# Altium schematic sheet InputOutput.SchDoc
size A4
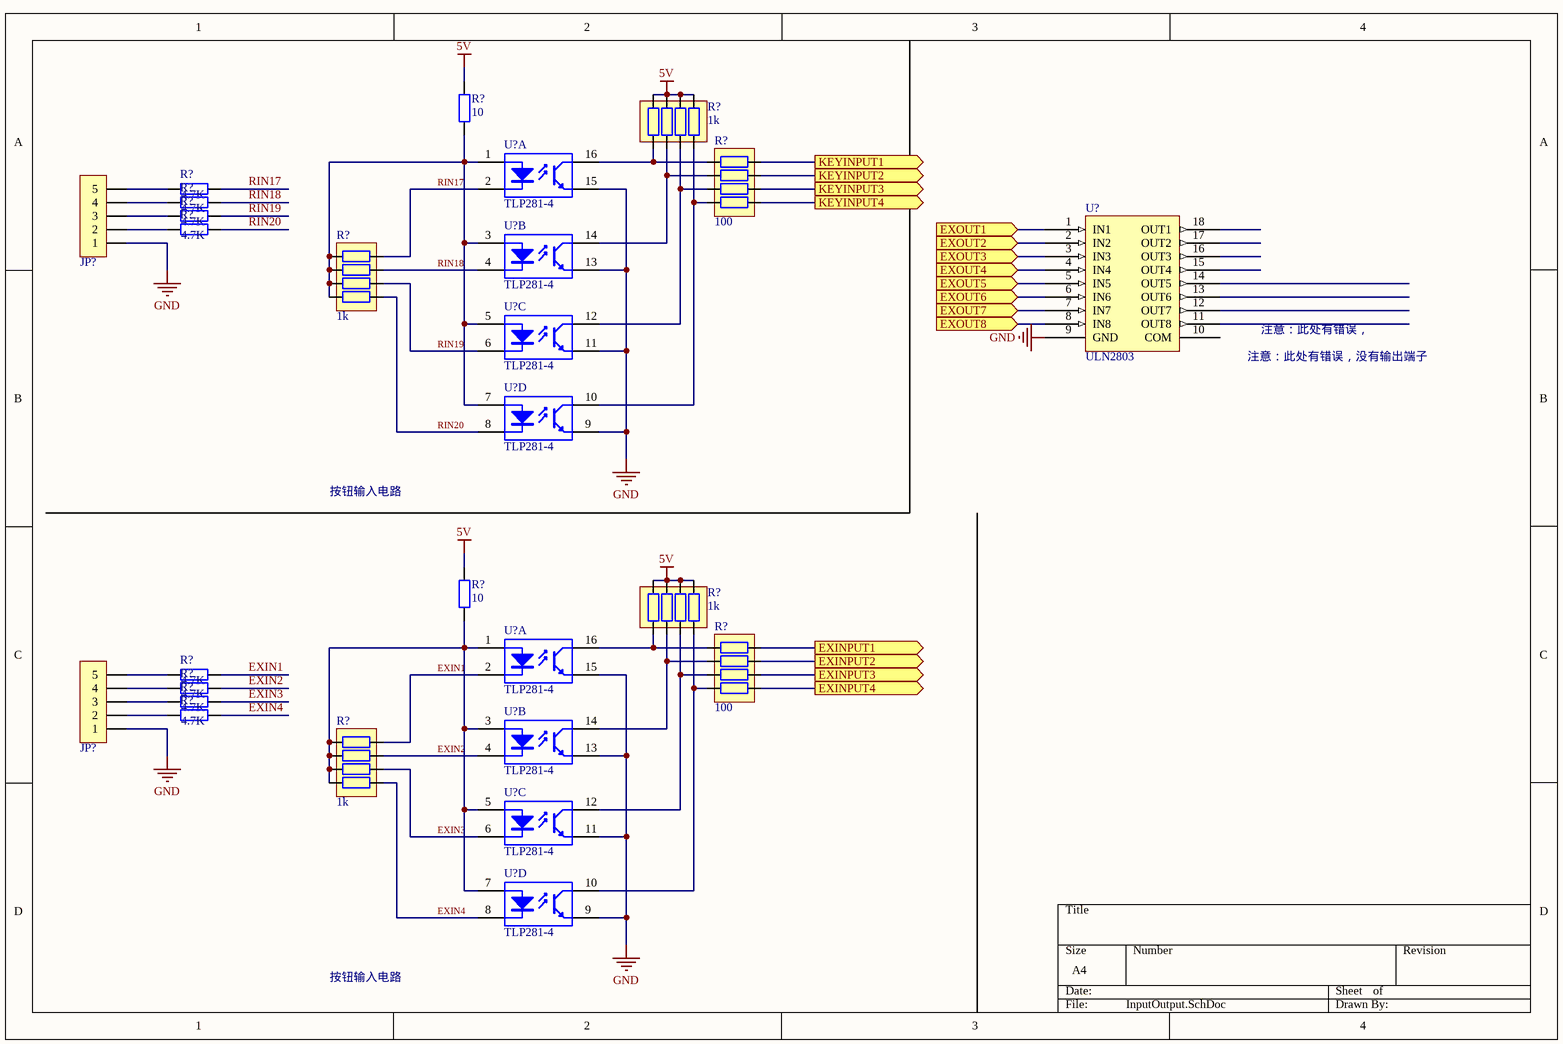
[diagram p0: InputOutput.SchDoc]

## Parts
(Parts that share a designator on the sheet are numbered #1, #2 ... from top to bottom, then left to right.)
JP?#1  HDR-1X5  [XH2.54-LI-5P]  (value not drawn)
JP?#2  HDR-1X5  [XH2.54-LI-5P]  (value not drawn)
R?#1  10  [R 0603_L]
R?#2  1k  [RCA-8P4R-0603]
R?#3  100  [RCA-8P4R-0603]
R?#4  4.7K  [R 0603_L]
R?#5  4.7K  [R 0603_L]
R?#6  4.7K  [R 0603_L]
R?#7  4.7K  [R 0603_L]
R?#8  1k  [RCA-8P4R-0603]
R?#9  10  [R 0603_L]
R?#10  1k  [RCA-8P4R-0603]
R?#11  100  [RCA-8P4R-0603]
R?#12  4.7K  [R 0603_L]
R?#13  4.7K  [R 0603_L]
R?#14  4.7K  [R 0603_L]
R?#15  4.7K  [R 0603_L]
R?#16  1k  [RCA-8P4R-0603]
U?#1  TLP281-4  [SOP16N_N]  (part A of 4)
U?#2  ULN2803  [SO-G18]
U?#3  TLP281-4  [SOP16N_n]  (part B of 4)
U?#4  TLP281-4  [SOP16N_n]  (part C of 4)
U?#5  TLP281-4  [SOP16N_n]  (part D of 4)
U?#6  TLP281-4  [SOP16N_N]  (part A of 4)
U?#7  TLP281-4  [SOP16N_n]  (part B of 4)
U?#8  TLP281-4  [SOP16N_n]  (part C of 4)
U?#9  TLP281-4  [SOP16N_n]  (part D of 4)

## Ports
EXINPUT1 (out), EXINPUT2 (out), EXINPUT3 (out), EXINPUT4 (out), EXOUT1 (in), EXOUT2 (in), EXOUT3 (in), EXOUT4 (in), EXOUT5 (in), EXOUT6 (in), EXOUT7 (in), EXOUT8 (in), KEYINPUT1 (out), KEYINPUT2 (out), KEYINPUT3 (out), KEYINPUT4 (out)

## Nets
5V: R?#1.1 R?#2.5 R?#2.6 R?#2.7 R?#2.8 R?#9.1 R?#10.5 R?#10.6 R?#10.7 R?#10.8
GND: JP?#1.1 JP?#2.1 U?#1.15 U?#2.9(GND) U?#3.13 U?#4.11 U?#5.9 U?#6.15 U?#7.13 U?#8.11 U?#9.9
EXIN1: R?#12.1 R?#16.8 U?#6.2
EXIN2: R?#13.1 R?#16.7 U?#7.4
EXIN3: R?#14.1 R?#16.6 U?#8.6
EXIN4: R?#15.1 R?#16.5 U?#9.8
EXINPUT1: R?#11.1 ; port EXINPUT1
EXINPUT2: R?#11.2 ; port EXINPUT2
EXINPUT3: R?#11.3 ; port EXINPUT3
EXINPUT4: R?#11.4 ; port EXINPUT4
EXOUT1: U?#2.1(IN1) ; port EXOUT1
EXOUT2: U?#2.2(IN2) ; port EXOUT2
EXOUT3: U?#2.3(IN3) ; port EXOUT3
EXOUT4: U?#2.4(IN4) ; port EXOUT4
EXOUT5: U?#2.5(IN5) ; port EXOUT5
EXOUT6: U?#2.6(IN6) ; port EXOUT6
EXOUT7: U?#2.7(IN7) ; port EXOUT7
EXOUT8: U?#2.8(IN8) ; port EXOUT8
KEYINPUT1: R?#3.1 ; port KEYINPUT1
KEYINPUT2: R?#3.2 ; port KEYINPUT2
KEYINPUT3: R?#3.3 ; port KEYINPUT3
KEYINPUT4: R?#3.4 ; port KEYINPUT4
RIN17: R?#4.1 R?#8.8 U?#1.2
RIN18: R?#5.1 R?#8.7 U?#3.4
RIN19: R?#6.1 R?#8.6 U?#4.6
RIN20: R?#7.1 R?#8.5 U?#5.8
NetJP?#1_2: JP?#1.2 R?#7.2
NetJP?#1_3: JP?#1.3 R?#6.2
NetJP?#1_4: JP?#1.4 R?#5.2
NetJP?#1_5: JP?#1.5 R?#4.2
NetJP?#2_2: JP?#2.2 R?#15.2
NetJP?#2_3: JP?#2.3 R?#14.2
NetJP?#2_4: JP?#2.4 R?#13.2
NetJP?#2_5: JP?#2.5 R?#12.2
NetR?#1_2: R?#1.2 R?#8.1 R?#8.2 R?#8.3 R?#8.4 U?#1.1 U?#3.3 U?#4.5 U?#5.7
NetR?#2_1: R?#2.1 R?#3.8 U?#1.16
NetR?#2_2: R?#2.2 R?#3.7 U?#3.14
NetR?#2_3: R?#2.3 R?#3.6 U?#4.12
NetR?#2_4: R?#2.4 R?#3.5 U?#5.10
NetR?#9_2: R?#9.2 R?#16.1 R?#16.2 R?#16.3 R?#16.4 U?#6.1 U?#7.3 U?#8.5 U?#9.7
NetR?#10_1: R?#10.1 R?#11.8 U?#6.16
NetR?#10_2: R?#10.2 R?#11.7 U?#7.14
NetR?#10_3: R?#10.3 R?#11.6 U?#8.12
NetR?#10_4: R?#10.4 R?#11.5 U?#9.10

Not connected (* = marked no-connect by the designer): U?#2 10(COM) 11(OUT8) 12(OUT7) 13(OUT6) 14(OUT5) 15(OUT4) 16(OUT3) 17(OUT2) 18(OUT1)

## Notes on the sheet
- 注意：此处有错误，没有输出端子
- 注意：此处有错误，
- 按钮输入电路

## Library data of the parts
JP?#1 JP?#2 = Header 5: 5P接插件; 版权归属: 源创客; BOM名称: 5P接插件; 学习资源: www.ooocke.com
R?#1 R?#4-R?#7 R?#9 R?#12-R?#15 = R: 贴片电阻; 版权归属: 源创客; BOM名称: 贴片电阻; 学习资源: www.ooocke.com
R?#2 R?#3 R?#8 R?#10 R?#11 R?#16 = R-8P4R: 贴片网络排阻; 版权归属: 源创客; BOM名称: 贴片网络排阻; 学习资源: www.ooocke.com